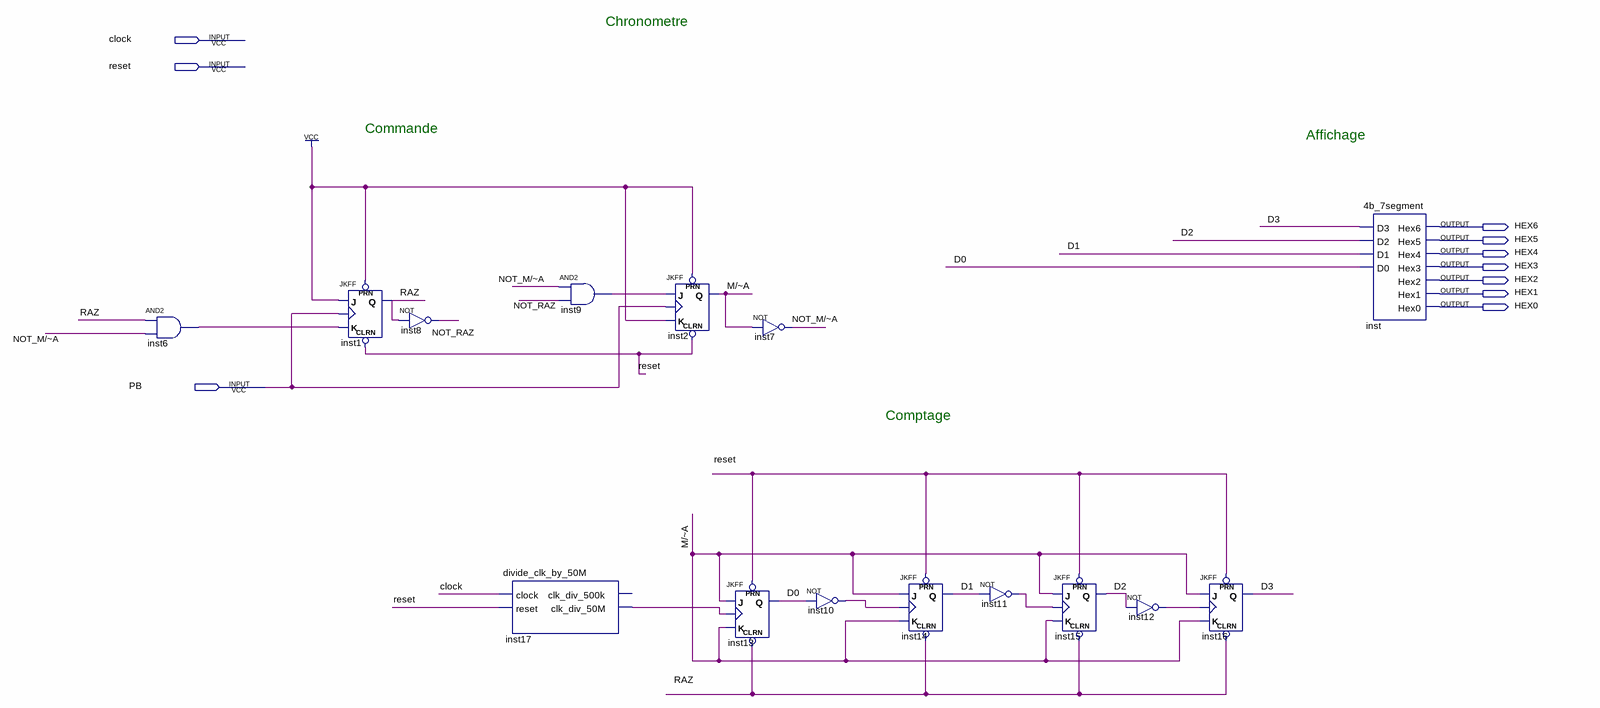
[diagram p0: schematic sheet]
// Quartus schematic pushbutton_counter.bdf as structural Verilog: 15 symbols, 10 pins
module pushbutton_counter (
  input  clock,
  input  reset,
  input  PB,
  output HEX6,
  output HEX5,
  output HEX4,
  output HEX3,
  output HEX2,
  output HEX1,
  output HEX0
);

  wire D0, D1, D2, D3, inst6_out, inst9_out, inst10_out, inst11_out, inst12_out, inst17_clk_div_50m, \M/~A ,
       \NOT_M/~A , NOT_RAZ, RAZ;

  and inst6 (inst6_out, RAZ, \NOT_M/~A );
  JKFF inst1 (.PRN(1'b1), .CLRN(reset), .K(inst6_out), .J(1'b1), .CLK(PB), .Q(RAZ));
  not inst8 (NOT_RAZ, RAZ);
  divide_clk_by_50M inst17 (.clock(clock), .reset(reset), .clk_div_50M(inst17_clk_div_50m));  // open: clk_div_500k
  and inst9 (inst9_out, \NOT_M/~A , NOT_RAZ);
  JKFF inst2 (.PRN(1'b1), .CLRN(reset), .K(1'b1), .J(inst9_out), .CLK(PB), .Q(\M/~A ));
  not inst7 (\NOT_M/~A , \M/~A );
  JKFF inst13 (.PRN(reset), .CLRN(RAZ), .K(\M/~A ), .J(\M/~A ), .CLK(inst17_clk_div_50m), .Q(D0));
  not inst10 (inst10_out, D0);
  JKFF inst14 (.PRN(reset), .CLRN(RAZ), .K(\M/~A ), .J(\M/~A ), .CLK(inst10_out), .Q(D1));
  not inst11 (inst11_out, D1);
  JKFF inst15 (.PRN(reset), .CLRN(RAZ), .K(\M/~A ), .J(\M/~A ), .CLK(inst11_out), .Q(D2));
  not inst12 (inst12_out, D2);
  JKFF inst16 (.PRN(reset), .CLRN(RAZ), .K(\M/~A ), .J(\M/~A ), .CLK(inst12_out), .Q(D3));
  \4b_7segment  inst (
    .D3(D3), .D2(D2), .D1(D1), .D0(D0), .Hex6(HEX6), .Hex5(HEX5), .Hex4(HEX4), .Hex3(HEX3), .Hex2(HEX2),
    .Hex1(HEX1), .Hex0(HEX0));

  // Notes on the sheet:
  //   Chronometre   
  //   Commande  
  //   Affichage  
  //   Comptage  
endmodule
